# EasyEDA Pro project ProPrj_fallctf2025badge_2025-09-24.epro, schematic badge-v1.0

## Sheets
1 P1: Board Name: badge-v1.0; Create Date: 2025-08-06; Page Name: P1; Project Name: fallctf2025badge; Schematic Name: badge-v1.0; Update Date: 2025-08-08; Company: EasyEDA.com; Page Size: A4; Version: V1.0
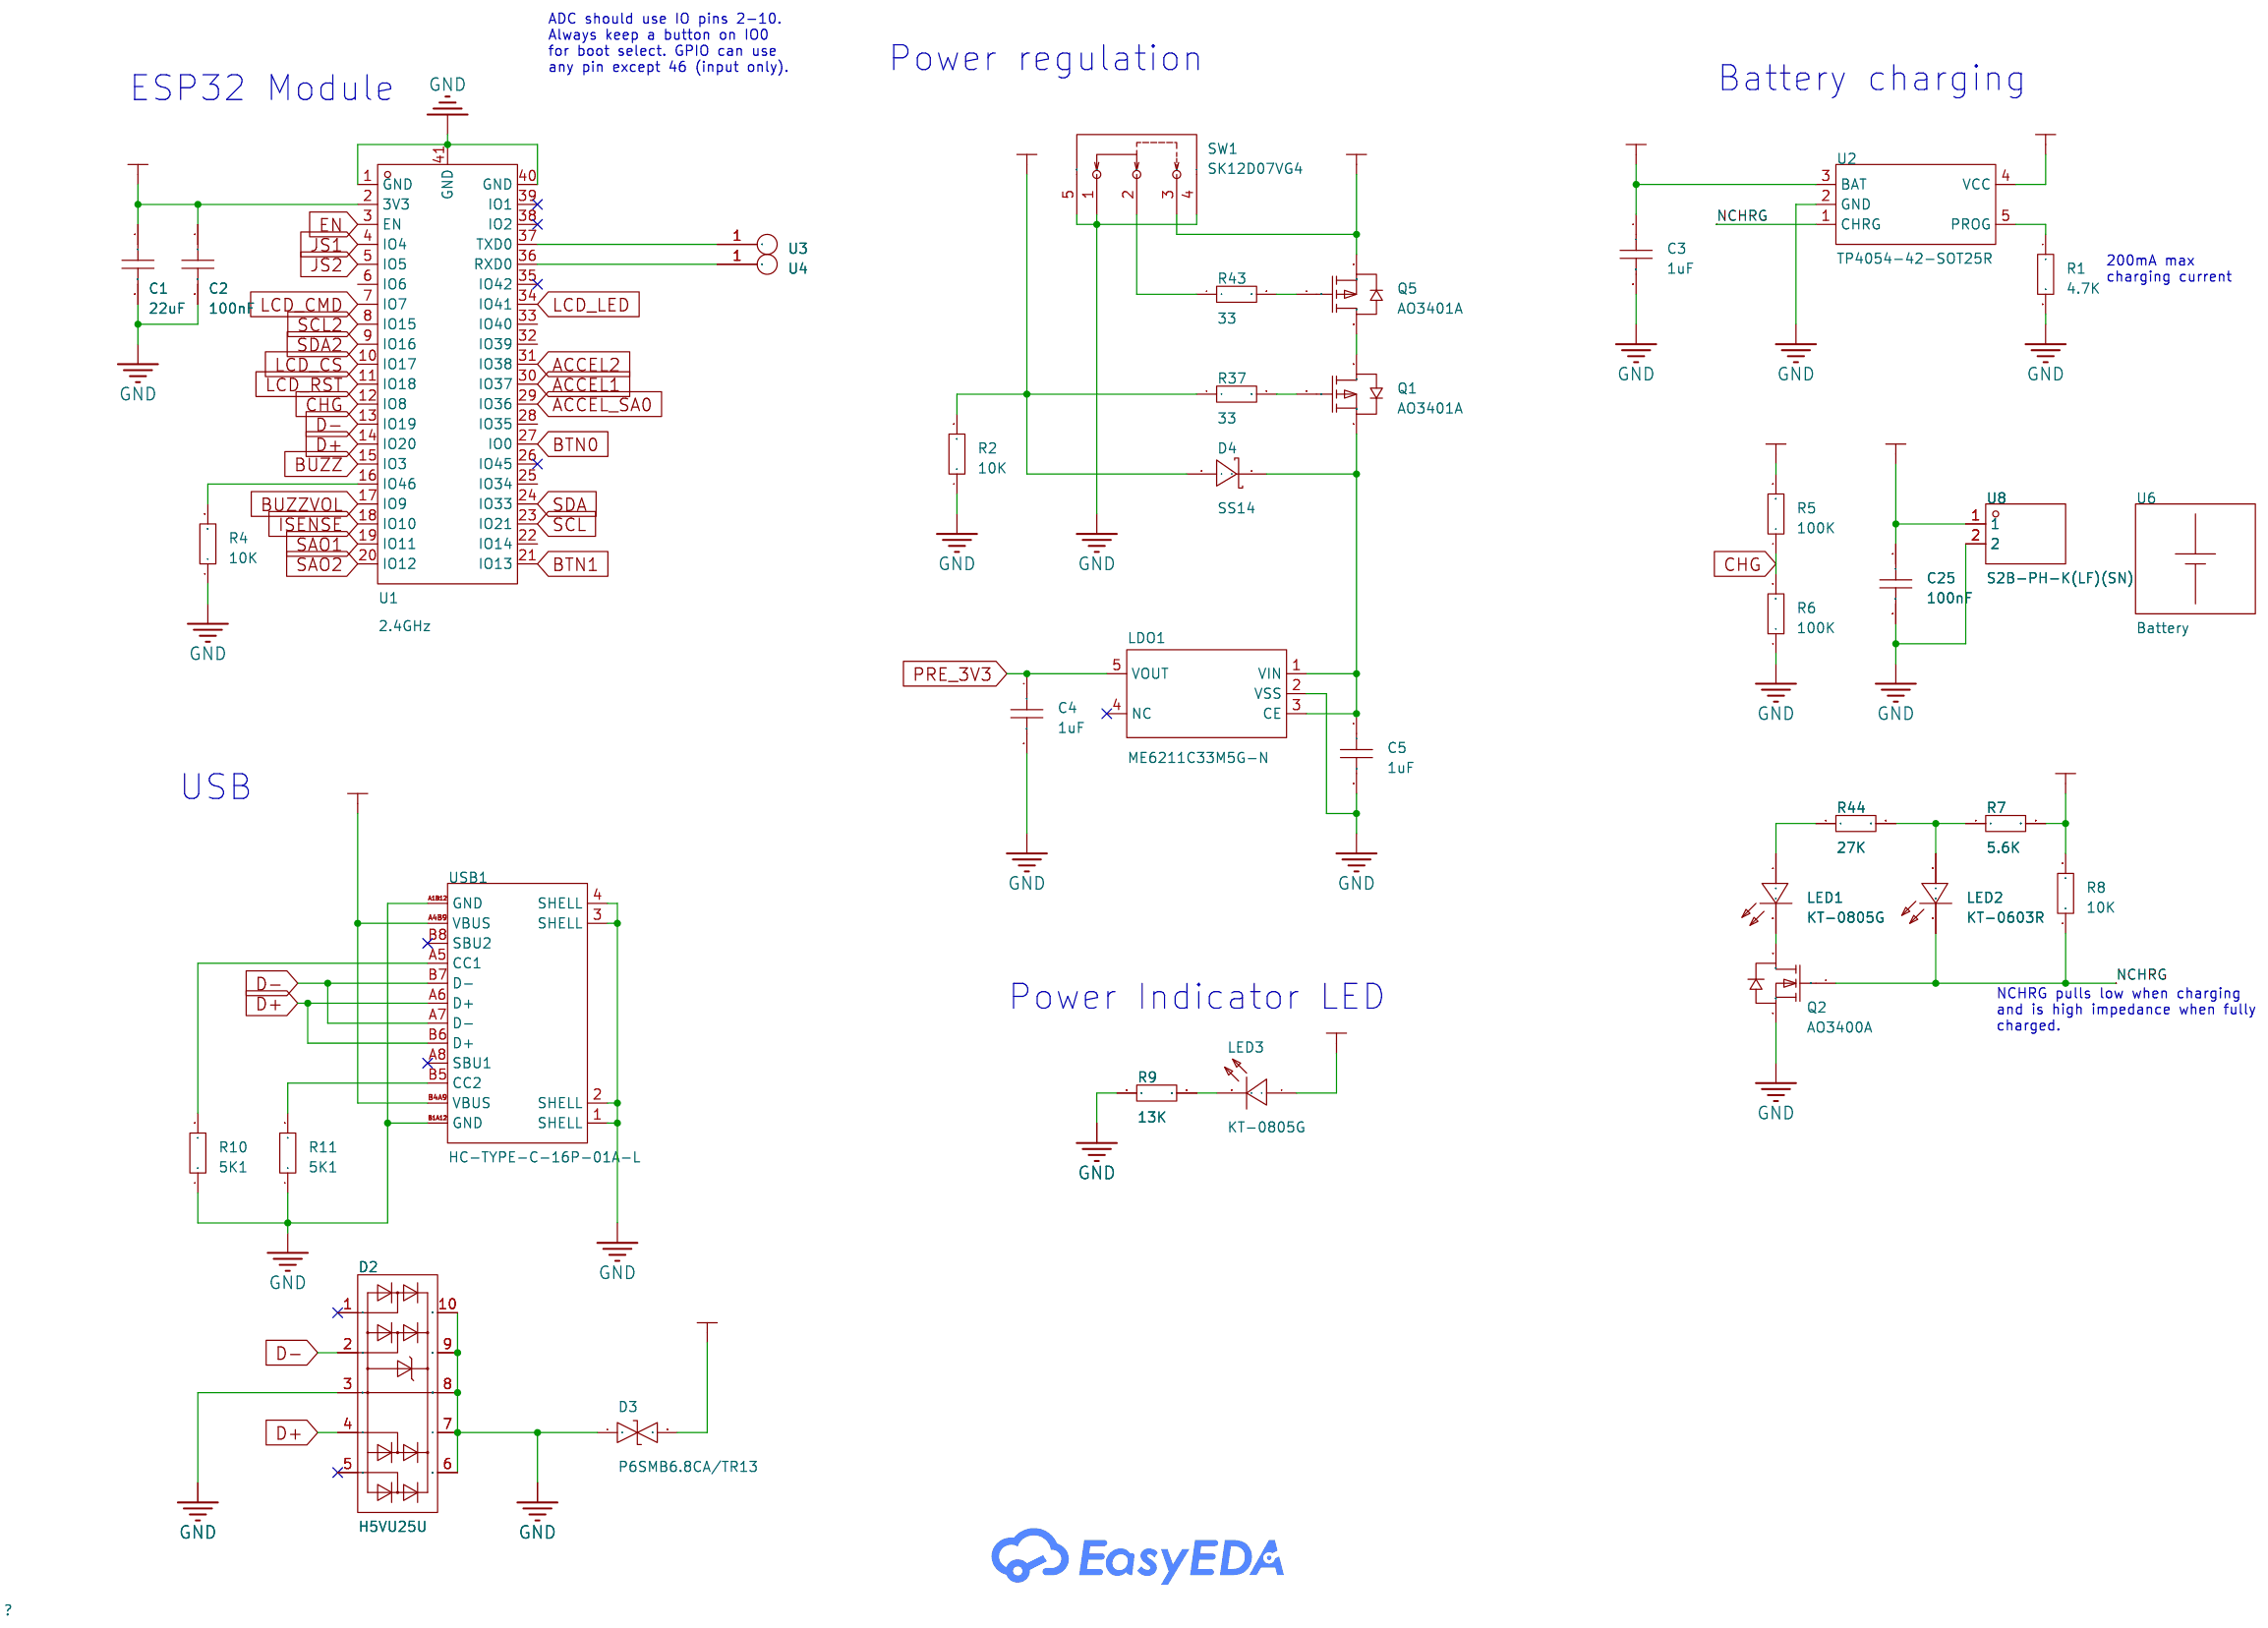
[diagram p8: P1]
2 P2: Page Name: P2; Update Date: 2025-08-07
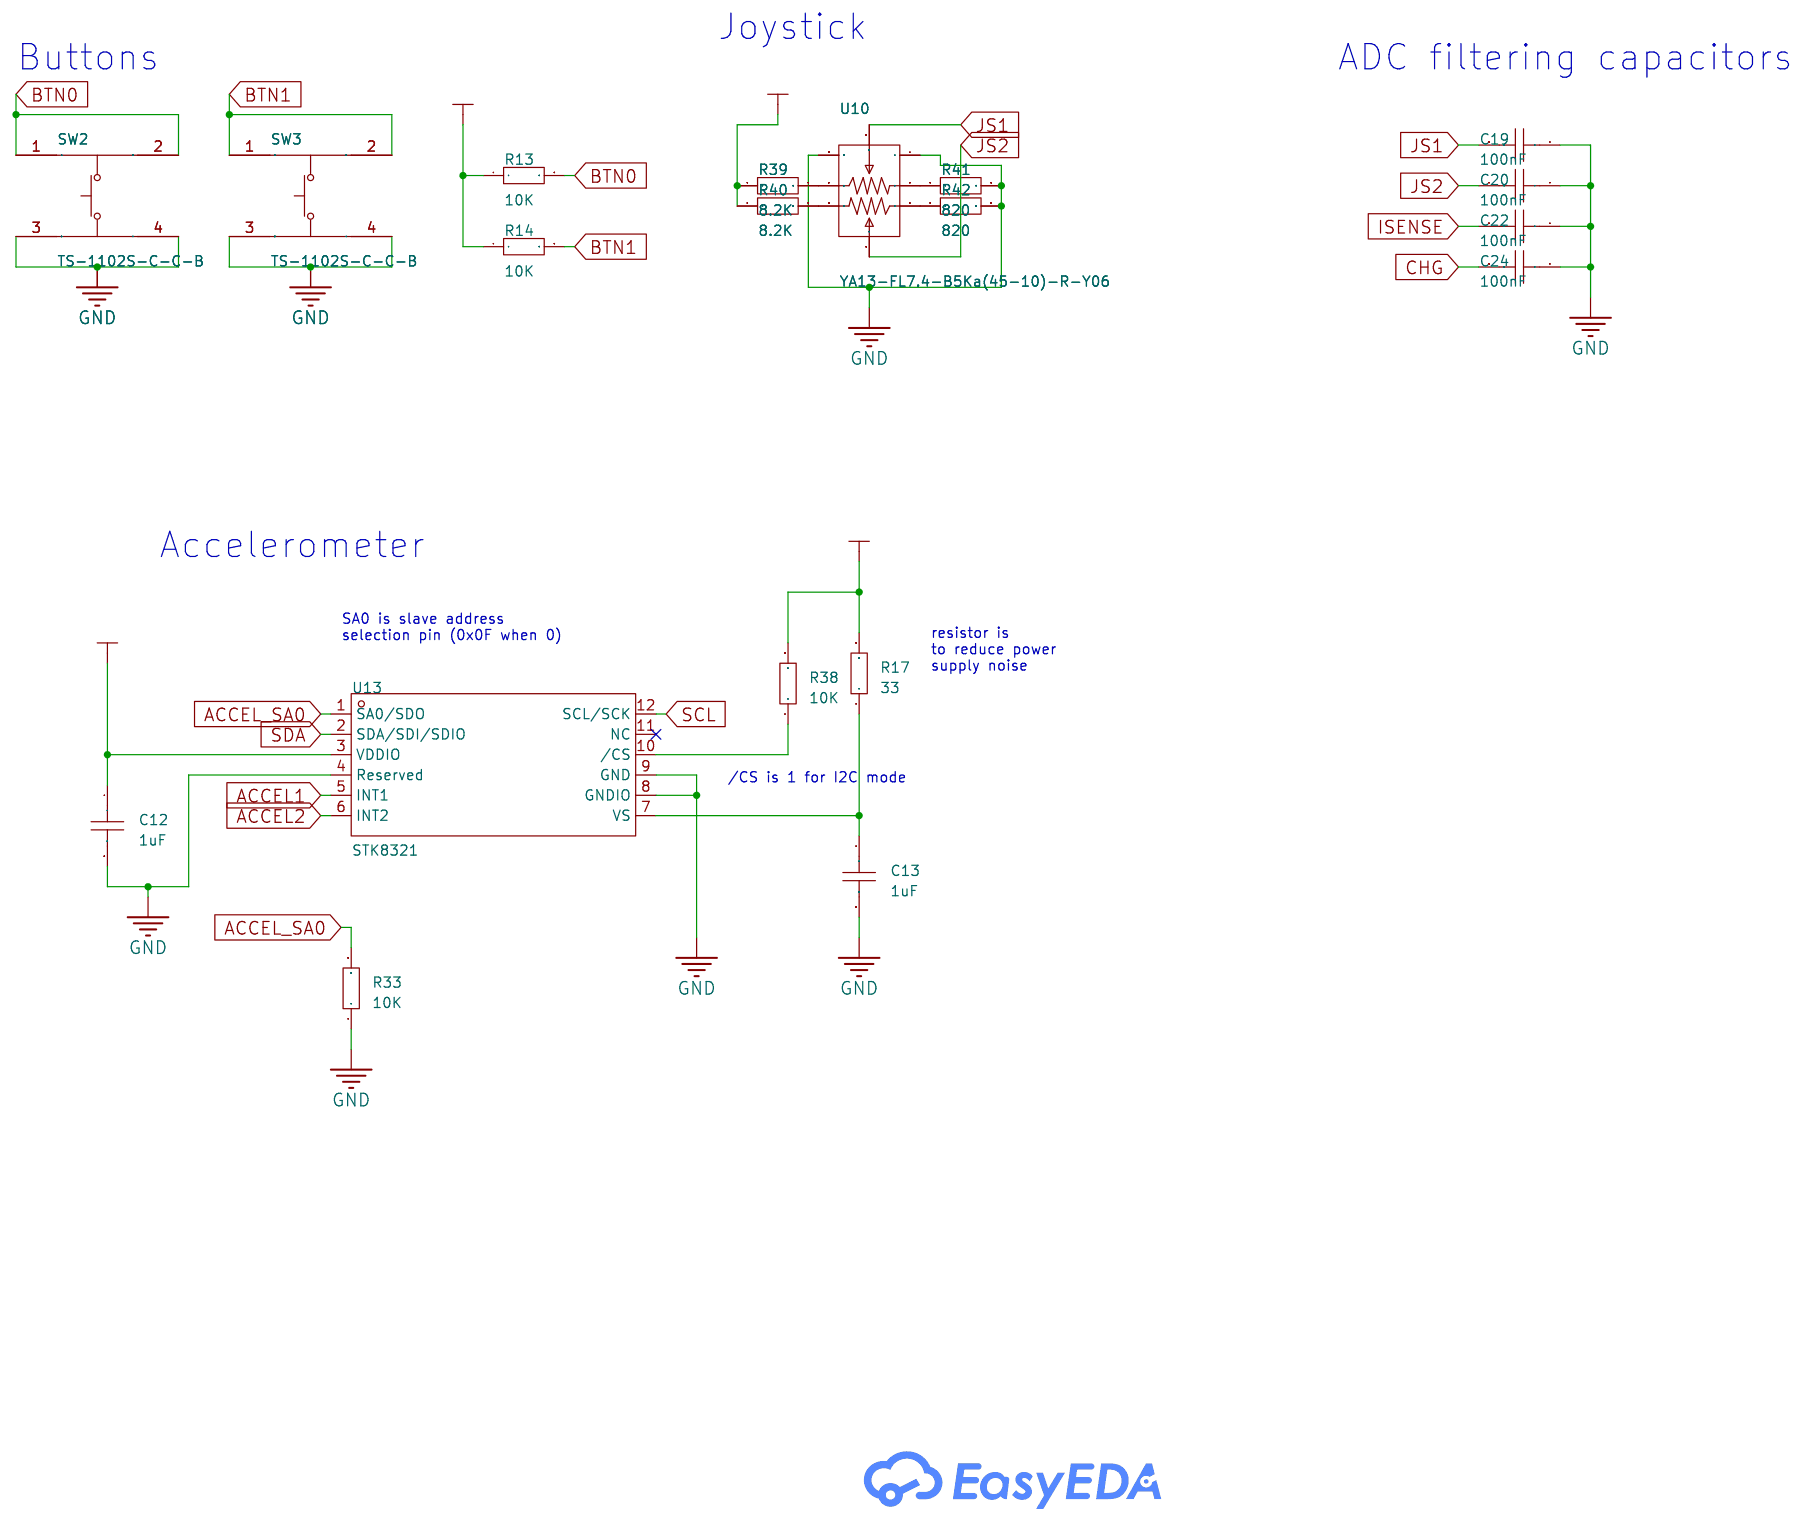
[diagram p9: P2]
3 P3: Page Name: P3; Update Date: 2025-08-07
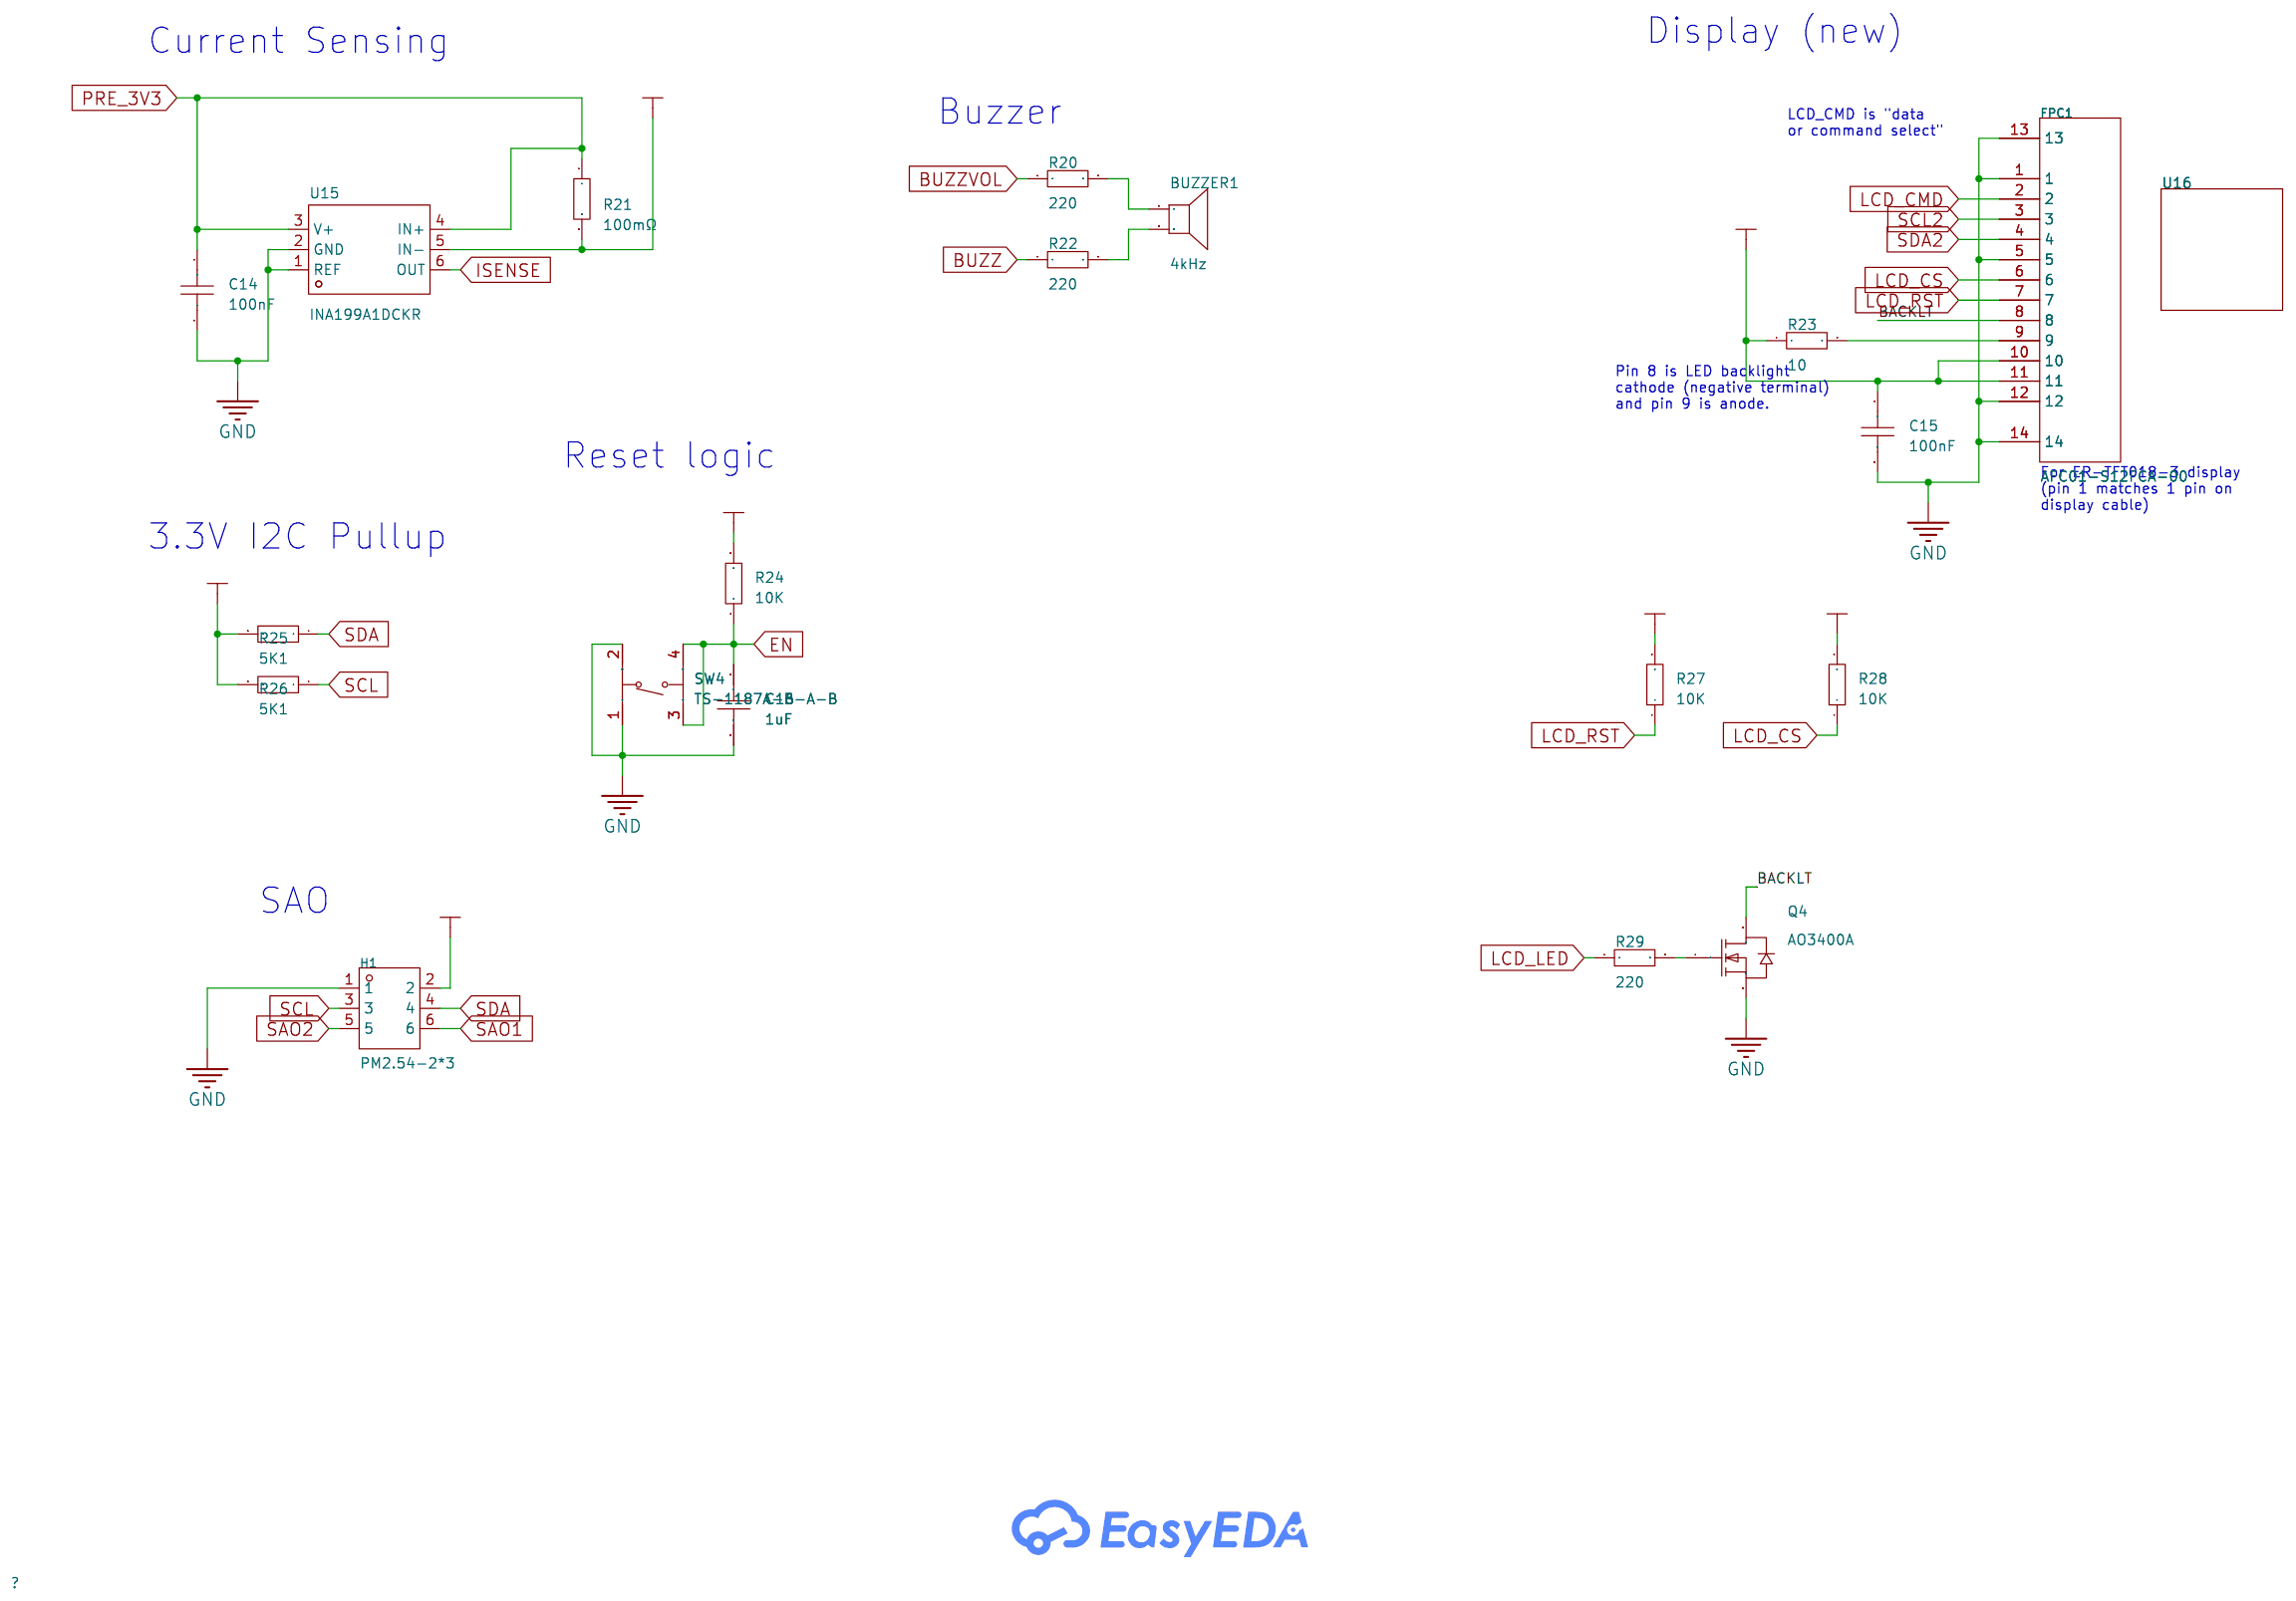
[diagram p10: P3]

## Parts
sheet P1
C1  22uF  [C0603]
C2  100nF  [C0603]
C3  1uF  [C0603]
C4  1uF  [C0603]
C5  1uF  [C0603]
C25  100nF  [C0603]
D2  H5VU25U  [DFN2510-10_L2.5-W1.0-P0.50-BL]
D3  P6SMB6.8CA/TR13  [SMB_L4.6-W3.6-LS5.3-BI]
D4  SS14  [SMA_L4.2-W2.6-LS5.3-RD]
LDO1  ME6211C33M5G-N  [SOT-23-5_L3.0-W1.7-P0.95-LS2.8-BL]
LED1  KT-0805G  [LED0805-R-RD]
LED2  KT-0603R  [LED0603-RD]
LED3  KT-0805G  [LED0805-R-RD]
Q1  AO3401A  [SOT-23_L2.9-W1.3-P1.90-LS2.4-BR]
Q2  AO3400A  [SOT-23-3_L2.9-W1.3-P1.90-LS2.4-BR]
Q5  AO3401A  [SOT-23_L2.9-W1.3-P1.90-LS2.4-BR]
R1  4.7K  [R0603]
R2  10K  [R0603]
R4  10K  [R0603]
R5  100K  [R0603]
R6  100K  [R0603]
R7  5.6K  [R0603]
R8  10K  [R0603]
R9  13K  [R0603]
R10  5K1  [R0603]
R11  5K1  [R0603]
R37  33  [R0603]
R43  33  [R0603]
R44  27K  [R0603]
SW1  SK12D07VG4  [SW-TH_SK12D07VG4]
U1  2.4GHz  [WIRELM-SMD_ESP32-S3-WROOM-1]
U2  TP4054-42-SOT25R  [SOT-23-5_L3.0-W1.7-P0.95-LS2.8-BL]
U3  -  [pad_THT]
U4  -  [pad_THT]
U6  Battery  [lipo_battery]
U8  S2B-PH-K(LF)(SN)  [CONN-TH_S2B-PH-K-LF-SN]
USB1  HC-TYPE-C-16P-01A-L  [USB-C-SMD_G-SWITCH_GT-USB-7010EN]
sheet P2
C12  1uF  [C0603]
C13  1uF  [C0603]
C19  100nF  [C0603]
C20  100nF  [C0603]
C22  100nF  [C0603]
C24  100nF  [C0603]
R13  10K  [R0603]
R14  10K  [R0603]
R17  33  [R0603]
R33  10K  [R0603]
R38  10K  [R0603]
R39  8.2K  [R0603]
R40  8.2K  [R0603]
R41  820  [R0603]
R42  820  [R0603]
SW2  TS-1102S-C-C-B  [KEY-SMD_4P-L6.0-W6.0-P4.50-LS8.6]
SW3  TS-1102S-C-C-B  [KEY-SMD_4P-L6.0-W6.0-P4.50-LS8.6]
U10  YA13-FL7.4-B5Ka(45-10)-R-Y06  [RES-ADJ-TH_YA13-FL7.4-B5KA-45-10-R-Y06_1]
U13  STK8321  [LGA-12_L2.0-W2.0-P0.50-TR]
sheet P3
BUZZER1  4kHz  [BUZ-TH_BD14.0-P7.60-D0.7]
C14  100nF  [C0603]
C15  100nF  [C0603]
C16  1uF  [C0603]
FPC1  AFC01-S12FCA-00  [FPC-SMD_AFC01-S12FCA-00]
H1  PM2.54-2*3  [HDR-TH_6P-P2.54-V-F-R2-C3-S2.54]
Q4  AO3400A  [SOT-23-3_L2.9-W1.3-P1.90-LS2.4-BR]
R20  220  [R0603]
R21  100mΩ  [R1206]
R22  220  [R0603]
R23  10  [R0603]
R24  10K  [R0603]
R25  5K1  [R0603]
R26  5K1  [R0603]
R27  10K  [R0603]
R28  10K  [R0603]
R29  220  [R0603]
SW4  TS-1187A-B-A-B  [SW-SMD_4P-L5.1-W5.1-P3.70-LS6.5-TL_H1.5]
U15  INA199A1DCKR  [SC-70-6_L2.2-W1.3-P0.65-LS2.1-BR]
U16  DISPLAY  [ER-TFT018-3]

## Library data of the parts
C1-C5 C12-C16 C19 C20 C22 C24 C25 = CAP_0603: Supplier Footprint: 0603
D2 = H5VU25U: polarity:Unidirectional Reverse Stand-Off Voltage (Vrwm):5V Maximum Clamping Voltage:14V Peak Pulse Current (Ipp):4A Peak Pulse Power Dissipation (Ppp):56W Breakdown Voltage:6V Reverse Leakage Current (Ir):1uA Number of Lines:Four channels Operating Tempe; LCSC Part Name: 丝印:0524P; Supplier Part: C7420374; Manufacturer: 宏迦橙; Supplier Footprint: DFN2510-10L; JLCPCB Part Class: Extended Part; Datasheet: https://atta.szlcsc.com/upload/public/pdf/source/20230630/91FD1DB17AB88B6832D3039FAE61FF10.pdf; Supplier: LCSC; polarity: Unidirectional; Reverse Stand-Off Voltage (Vrwm): 5V; Maximum Clamping Voltage: 14V; Peak Pulse Current (Ipp): 4A; Peak Pulse Power Dissipation (Ppp): 56W; Breakdown Voltage: 6V; Reverse Leakage Current (Ir): 1uA; Number of Lines: Four channels; Operating Temperature: -55℃~+155℃; Type: TVS
D3 = P6SMB6.8CA/TR13: Reverse Stand-Off Voltage (Vrwm):5.8V Clamping Voltage:10.5V Peak Pulse Current (Ipp):58.1A Peak Pulse Power Dissipation (Ppp):600W Voltage - Breakdown:6.45V Type:TVS; Supplier Part: C78395; Manufacturer: Brightking(君耀电子); Supplier Footprint: SMB(DO-214AA); JLCPCB Part Class: Basic Part; Datasheet: https://atta.szlcsc.com/upload/public/pdf/source/20160709/1468031879762.pdf; Supplier: LCSC; Reverse Stand-Off Voltage (Vrwm): 5.8V; Clamping Voltage: 10.5V; Peak Pulse Current (Ipp): 58.1A; Peak Pulse Power Dissipation (Ppp): 600W; Voltage - Breakdown: 6.45V; Type: TVS
D4 = SS14_C2480: Diode Configuration:Independent Type Forward Voltage (Vf@If):550mV@1A Reverse Voltage (Vr):40V Rectified Current:1A Reverse Leakage Current (Ir):300uA@40V; LCSC Part Name: 电压:40V 电流:1A; Supplier Part: C2480; Manufacturer: MDD(辰达半导体); Supplier Footprint: SMA(DO-214AC); JLCPCB Part Class: Basic Part; Datasheet: https://atta.szlcsc.com/upload/public/pdf/source/20240710/EF24798823EE33D63F154ED67BAC5E71.pdf; Supplier: LCSC; Diode Configuration: Independent Type; Forward Voltage (Vf@If): 550mV@1A; Reverse Voltage (Vr): 40V; Rectified Current: 1A; Reverse Leakage Current (Ir): 300uA@40V
LDO1 = ME6211C33M5G-N: Output Type:Fixed Voltage - Supply:6V Output Voltage:3.3V Output Voltage:3.3V Output Current:500mA Power Supply Rejection Ratio (PSRR):70dB@(1kHz) Voltage Dropout:120mV@(100mA) standby current:60uA Noise:50uVrms Features:Over Current Protection；Enable；Sho; LCSC Part Name: 输入6V 输出3.3V 500mA; Supplier Part: C82942; Manufacturer: MICRONE(南京微盟); Supplier Footprint: SOT-23-5; JLCPCB Part Class: Extended Part; Datasheet: https://atta.szlcsc.com/upload/public/pdf/source/20170918/C82942_1505727073070976520.pdf; Supplier: LCSC; Output Type: Fixed; Voltage - Supply: 6V; Output Voltage: 3.3V; Output Current: 500mA; Power Supply Rejection Ratio (PSRR): 70dB@(1kHz); Voltage Dropout: 120mV@(100mA); standby current: 60uA; Noise: 50uVrms; Features: Over Current Protection；Enable；Short Circuit Protection; Operating Temperature: -40℃~+150℃; Output Configuration: Positive; Number of Outputs: 1
LED1 LED3 = KT-0805G: Lamp Holder Type:- Emitted Color:Emerald Forward Voltage (VF):- Forward Voltage (VF):- Power Dissipation:- Forward Current:- Dominant Wavelength:- Dominant Wavelength:- Peak Wavelength:- Diode Configuration:- Lens Color:- Color Temperature:- Color Tempera; LCSC Part Name: 0805 翠绿 高亮; Supplier Part: C2297; Manufacturer: KENTO; Supplier Footprint: 0805; JLCPCB Part Class: Basic Part; Datasheet: https://atta.szlcsc.com/upload/public/pdf/source/20170209/1486607340485.pdf; Supplier: LCSC; Emitted Color: Emerald
LED2 = KT-0603R: Emitted Color:Red Power Dissipation:- Forward Current:- Dominant Wavelength:- Dominant Wavelength:- Peak Wavelength:- Diode Configuration:- Lens Color:- Color Temperature:- Color Temperature:- Viewing Angle:- Mounting Sytle:- Operating Temperature:-40℃~+8; LCSC Part Name: 0603 红灯 高亮; Supplier Part: C2286; Manufacturer: KENTO; Supplier Footprint: 0603; JLCPCB Part Class: Basic Part; Datasheet: https://atta.szlcsc.com/upload/public/pdf/source/20160616/1466072038404.pdf; Supplier: LCSC; Emitted Color: Red; Operating Temperature: -40℃~+85℃
Q1 Q5 = AO3401A_C15127: Type:1 Piece P-Channel Drain Source Voltage (Vdss): Continuous Drain Current (Id): Drain Source On Resistance (RDS(on)@Vgs,Id):44mΩ@10V,4.3A Power Dissipation (Pd): Gate Threshold Voltage (Vgs(th)@Id):1.3V@250uA Total Gate Charge (Qg@Vgs):12.2nC@4.5V Inpu; LCSC Part Name: 1个P沟道 耐压:30V 电流:4A; Supplier Part: C15127; Manufacturer: AOS; Supplier Footprint: SOT-23; JLCPCB Part Class: Basic Part; Datasheet: https://atta.szlcsc.com/upload/public/pdf/source/20160507/1462613609053.pdf; Supplier: LCSC; Type: 1 Piece P-Channel; Drain Source On Resistance (RDS(on)@Vgs,Id): 44mΩ@10V,4.3A; Gate Threshold Voltage (Vgs(th)@Id): 1.3V@250uA; Total Gate Charge (Qg@Vgs): 12.2nC@4.5V; Input Capacitance (Ciss@Vds): 1.2nF@15V; Operating Temperature: -55℃~+150℃@(Tj)
Q2 Q4 = AO3400A_C20917: Type:1 N-Channel Drain Source Voltage (Vdss): Continuous Drain Current (Id): Drain Source On Resistance (RDS(on)@Vgs,Id):26.5mΩ@10V,5.7A Power Dissipation (Pd): Gate Threshold Voltage (Vgs(th)@Id):1.5V@250uA Total Gate Charge (Qg@Vgs):7nC@4.5V Input Capac; LCSC Part Name: 1个N沟道 耐压:30V 电流:5.7A; Supplier Part: C20917; Manufacturer: AOS; Supplier Footprint: SOT-23-3L; JLCPCB Part Class: Basic Part; Datasheet: https://atta.szlcsc.com/upload/public/pdf/source/20140107/1457706668533.pdf; Supplier: LCSC; Type: 1 N-Channel; Drain Source On Resistance (RDS(on)@Vgs,Id): 26.5mΩ@10V,5.7A; Gate Threshold Voltage (Vgs(th)@Id): 1.5V@250uA; Total Gate Charge (Qg@Vgs): 7nC@4.5V; Input Capacitance (Ciss@Vds): 630pF@15V; Operating Temperature: -55℃~+150℃@(Tj)
R1 R2 R4-R11 R13 R14 R17 R20 R22-R29 R33 R37-R44 = Res_0603: Supplier Footprint: 0603
SW1 = SK12D07VG4: Circuit:SPDT Actuator Style:Rectangular columnar Pin Style:PCPin Switch Height:8.8mm Mounting Style:- Current Rating (DC):500mA Voltage Rating (DC):50V Current Rating (AC):- Voltage Rating (AC):- Mechanical Life:5千次 Operating Temperature:- Operating Tempe; LCSC Part Name: 3脚2档位 卧插 滑动开关; Supplier Part: C393937; Manufacturer: SHOU HAN(首韩); Supplier Footprint: 插件; JLCPCB Part Class: Extended Part; Datasheet: https://atta.szlcsc.com/upload/public/pdf/source/20190521/C393937_939FE26E571CC67D2D532E953108A1B0.pdf; Supplier: LCSC; Circuit: SPDT; Actuator Style: Rectangular columnar; Pin Style: PCPin; Switch Height: 8.8mm; Current Rating (DC): 500mA; Voltage Rating (DC): 50V; Mechanical Life: 5千次
U1 = ESP32-S2-SOLO-2-N4: Core Processor:ESP32-S2 chip Support Interface:I2C；GPIO；SPI；PWM；ADC；UART；USB；I2S Frequency:2.4GHz Output Power:19.5dBm Output Power:19.5dBm; Supplier Part: C3040594; Manufacturer: ESPRESSIF(乐鑫); Supplier Footprint: SMD-41P; JLCPCB Part Class: Extended Part; Datasheet: https://atta.szlcsc.com/upload/public/pdf/source/20241030/23A98F852E1EE1BC8A41B3B2EC18FA38.pdf; Supplier: LCSC; Core Processor: ESP32-S2 chip; Support Interface: I2C；GPIO；SPI；PWM；ADC；UART；USB；I2S; Output Power: 19.5dBm
U2 = TP4054-42-SOT25R: Supplier Part: C32574; Manufacturer: TOPPOWER(南京拓微); Supplier Footprint: SOT-23-5; JLCPCB Part Class: Extended Part; Datasheet: https://atta.szlcsc.com/upload/public/pdf/source/20140621/1457707095588.pdf; Supplier: LCSC
U3 U4 = pad_THT
U6 = lipo_battery
U8 = S2B-PH-K(LF)(SN): Pins Structure:1x2P Pitch:2mm Mounting Style:Right-Angle Reference Series:PH Number of Pins:2P Number of Rows:1 Number of PINs Per Row:2 Row Spacing:- Current Rating (Max):2A Contact Material:Brass Contact Plating:Tin Operating Temperature Range:-25℃~+85℃; LCSC Part Name: 1x2P 间距:2mm 弯插 系列:PH; Supplier Part: C265016; Manufacturer: JST; Supplier Footprint: 弯插,P=2mm; JLCPCB Part Class: Extended Part; Datasheet: https://atta.szlcsc.com/upload/public/pdf/source/20181010/C265101_22107ACC4D8714694FDA2DD97145FA81.pdf; Supplier: LCSC; Pins Structure: 1x2P; Pitch: 2mm; Mounting Style: Right-Angle; Reference Series: PH; Number of Pins: 2P; Number of Rows: 1; Number of PINs Per Row: 2; Current Rating (Max): 2A; Contact Material: Brass; Contact Plating: Tin; Operating Temperature Range: -25℃~+85℃; Rated Voltage (Max): 100V; Plastic Material: PA66; Flame Retardant Rating: UL94V-0; Supplementary Features: 打K脚; Colour: White; Z-Height of the Board: 4.8mm; X-Length of Bottom Edge on Board (Spacing Line): 5.9mm; Y-Width of Bottom Edge on Board: 7.6mm
USB1 = HC-TYPE-C-16P-01A-L: Connector Type:Type-C Standard:USB 3.1 Gender:Female Number of Ports:1 Number of Contacts:16P Mounting Style:卧贴 Current Rating - Power (Max):3A Contact Material:高导铜 Contact Plating:Gold Operating Temperature Range:-25℃~+85℃ Operating Temperature Range:-25; LCSC Part Name: Type-C 母 卧贴; Supplier Part: C2997432; Manufacturer: HCTL(华灿天禄); Supplier Footprint: SMD; JLCPCB Part Class: Extended Part; Datasheet: https://atta.szlcsc.com/upload/public/pdf/source/20221116/C788B956BC5B2689BB81EF44F8093A01.pdf; Supplier: LCSC; Connector Type: Type-C; Standard: USB 3.1; Gender: Female; Number of Ports: 1; Number of Contacts: 16P; Mounting Style: 卧贴; Current Rating - Power (Max): 3A; Contact Material: 高导铜; Contact Plating: Gold; Operating Temperature Range: -25℃~+85℃; Soldering Temperature(Max): 260℃
SW2 SW3 = TS-1102S-C-C-B: Circuit:SPST Actuator Style:Round Button Operating Force:260gf Mounting Style:Brick nogging Switch Length:6mm Switch Width:6mm Switch Height:5mm Strike Gundam:不带 Contact Current:50mA Voltage Rating (DC):12V Insulation Resistance:- Actuator/Cap Color:Black; LCSC Part Name: 6*6*5mm 立贴 轻触开关; Supplier Part: C381039; Manufacturer: XKB Connectivity(中国星坤); Supplier Footprint: SMD; JLCPCB Part Class: Extended Part; Datasheet: https://atta.szlcsc.com/upload/public/pdf/source/20211011/2711A6933F86C308D94098377C07E7B1.pdf; Supplier: LCSC; Circuit: SPST; Actuator Style: Round Button; Operating Force: 260gf; Mounting Style: Brick nogging; Switch Length: 6mm; Switch Width: 6mm; Switch Height: 5mm; Strike Gundam: 不带; Contact Current: 50mA; Voltage Rating (DC): 12V; Actuator/Cap Color: Black; With Lamp: No; Mechanical Life: 30万次; Operating Temperature: -20℃~+70℃
U10 = YA13-FL7.4-B5Ka(45-10)-R-Y06: Supplier Part: C37323742; Manufacturer: YTL(亚特联); Supplier Footprint: 插件-10P,16.7x16.7mm; JLCPCB Part Class: Extended Part; Datasheet: https://atta.szlcsc.com/upload/public/pdf/source/20240806/54F6EE709261E515BD8523FEFD4A47EF.pdf; Supplier: LCSC
U13 = STK8321: Supplier Part: C966924; Manufacturer: SENSORTEK(昇佳); Supplier Footprint: LGA-12(2x2); JLCPCB Part Class: Extended Part; Datasheet: https://atta.szlcsc.com/upload/public/pdf/source/20210108/C966924_A4D777CCA047E4BCE52C7136D49F7338.pdf; Supplier: LCSC
BUZZER1 = SFN-1407PA7.6: Driver Circuitry:Passive (external drive) Technology:Piezoelectric Voltage - Supply:- Voltage - Supply:- Frequency:4kHz Current Consumption:- Sound Pressure Level(SPL):85dB Diameter(φD):14mm Length:- Width:- Height:7.5mm Operating Temperature:- Operating; LCSC Part Name: 压电无源蜂鸣器; Supplier Part: C360603; Manufacturer: S&S(海旭); Supplier Footprint: 插件,D=14mm; JLCPCB Part Class: Extended Part; Datasheet: https://atta.szlcsc.com/upload/public/pdf/source/20190422/C360603_0050A9658ADA60D80C9948846F925782.pdf; Supplier: LCSC; Driver Circuitry: Passive (external drive); Technology: Piezoelectric; Sound Pressure Level(SPL): 85dB; Diameter(φD): 14mm; Height: 7.5mm
FPC1 = AFC01-S12FCA-00: Locking Feature:Clamshell Contact Type:Bottom Contact Number of Contacts:12P Pitch:0.5mm Mounting Type:卧贴 FFC, FCB Thickness:0.3mm FFC, FCB Thickness:0.3mm Height Above Board:2mm; LCSC Part Name: 间距:0.5mm P数:12P 翻盖式 下接; Supplier Part: C262661; Manufacturer: JS(钜硕电子); Supplier Footprint: SMD,P=0.5mm,卧贴; JLCPCB Part Class: Extended Part; Datasheet: https://atta.szlcsc.com/upload/public/pdf/source/20190816/C413942_2A72D1AC756EAE17EEDF756A339D4500.pdf; Supplier: LCSC; Locking Feature: Clamshell; Contact Type: Bottom Contact; Number of Contacts: 12P; Pitch: 0.5mm; Mounting Type: 卧贴; FFC, FCB Thickness: 0.3mm; Height Above Board: 2mm
H1 = PM2.54-2*3: Holes Structure:2x3P Pitch:2.54mm Row Spacing:2.54mm Circular Hole / Square Hole:方孔 Mounting Type:Straight Number of Rows:双排 Number of Holes:6P Current Rating (Max):2.5A Holes Direction:Top Insulation Height:8.5mm Operating Temperature Range:-40℃~+105℃ Op; LCSC Part Name: 间距:2.54mm 2x3P 直插; Supplier Part: C5116527; Manufacturer: ZHOURI(洲日); Supplier Footprint: 插件,P=2.54mm; JLCPCB Part Class: Extended Part; Datasheet: https://atta.szlcsc.com/upload/public/pdf/source/20220729/B685A447B6E7D9EA1A3EF6B07540DD20.pdf; Supplier: LCSC; Holes Structure: 2x3P; Pitch: 2.54mm; Row Spacing: 2.54mm; Circular Hole / Square Hole: 方孔; Mounting Type: Straight; Number of Rows: 双排; Number of Holes: 6P; Current Rating (Max): 2.5A; Holes Direction: Top; Insulation Height: 8.5mm; Operating Temperature Range: -40℃~+105℃
R21 = RL12FTNR100: Resistance: Tolerance:±1% Tolerance:±1% Power(Watts): Temperature Coefficient:±200ppm/℃ Temperature Coefficient:±200ppm/℃; LCSC Part Name: 100mΩ ±1% 500mW; Supplier Part: C188071; Manufacturer: 大毅科技; Supplier Footprint: 1206; JLCPCB Part Class: Extended Part; Datasheet: https://atta.szlcsc.com/upload/public/pdf/source/20180614/C188071_126E822E8169D657E3D39CA4797EDEB1.pdf; Supplier: LCSC; Tolerance: ±1%; Temperature Coefficient: ±200ppm/℃
SW4 = TS-1187A-B-A-B: Circuit:SPST Actuator Style:Round Button Operating Force:160gf Mounting Style:Brick nogging Switch Length:5.1mm Switch Width:5.1mm Switch Height:1.5mm Strike Gundam:不带 Contact Current:50mA Voltage Rating (DC):12V Insulation Resistance:- Actuator/Cap Color; LCSC Part Name: 5.1*5.1*1.5mm 立贴 轻触开关; Supplier Part: C318884; Manufacturer: XKB Connectivity(中国星坤); Supplier Footprint: SMD; JLCPCB Part Class: Basic Part; Datasheet: https://atta.szlcsc.com/upload/public/pdf/source/20200227/C318890_053E50208A88A7BA1965D8746000774E.pdf; Supplier: LCSC; Circuit: SPST; Actuator Style: Round Button; Operating Force: 160gf; Mounting Style: Brick nogging; Switch Length: 5.1mm; Switch Width: 5.1mm; Switch Height: 1.5mm; Strike Gundam: 不带; Contact Current: 50mA; Voltage Rating (DC): 12V; Actuator/Cap Color: 金色; With Lamp: No; Mechanical Life: 10万次; Operating Temperature: -30℃~+85℃
U15 = INA199A1DCKR: Supply Voltage:-300mV~26V Supply Voltage:-300mV~26V Supply Current:300uA Operating Temperature:-40℃~+125℃ Operating Temperature:-40℃~+125℃; Supplier Part: C59135; Manufacturer: TI(德州仪器); Supplier Footprint: SOT-363(SC-70-6); JLCPCB Part Class: Extended Part; Datasheet: https://www.ti.com/cn/lit/gpn/ina199; Supplier: LCSC; Supply Voltage: -300mV~26V; Supply Current: 300uA; Operating Temperature: -40℃~+125℃
U16 = ER-TFT018-3

## Nets
+3.3V: C1.1 C2.1 C12.1 C15.1 FPC1.10 FPC1.11 H1.2 LED3.1(A) R13.1 R14.1 R17.2 R21.2 R23.1 R24.2 R25.2 R26.2 R27.2 R28.2 R38.2 R39.1 R40.1 U1.2(3V3) U13.3(VDDIO) U15.5(IN-)
+5V: D3.2 D4.2(A) R2.2 R7.2 R8.2 R37.1 U2.4(VCC) USB1.A4B9(VBUS) USB1.B4A9(VBUS)
GND: C1.2 C2.2 C3.2 C4.2 C5.2 C12.2 C13.2 C14.2 C15.2 C16.2 C19.1 C20.1 C22.1 C24.1 C25.2 D2.3 D2.6 D2.7 D2.8 D2.9 D2.10 D3.1 FPC1.1 FPC1.5 FPC1.12 FPC1.13 FPC1.14 H1.1 LDO1.2(VSS) Q2.2(S) Q4.2(S) R1.2 R2.1 R4.1 R6.1 R9.1 R10.1 R11.1 R33.1 R41.2 R42.2 SW1.1 SW1.4 SW1.5 SW2.3 SW2.4 SW3.3 SW3.4 SW4.1(A) SW4.2(B) U1.1(GND) U1.40(GND) U1.41(GND) U2.2(GND) U8.2 U10.7 U10.8 U13.4(Reserved) U13.8(GNDIO) U13.9(GND) U15.1(REF) U15.2(GND) USB1.1(SHELL) USB1.2(SHELL) USB1.3(SHELL) USB1.4(SHELL) USB1.A1B12(GND) USB1.B1A12(GND)
VBAT: C3.1 C25.1 Q5.2(S) R5.2 SW1.3 U2.3(BAT) U8.1
ACCEL1: U1.30(IO37) U13.5(INT1)
ACCEL2: U1.31(IO38) U13.6(INT2)
ACCEL_SA0: R33.2 U1.29(IO36) U13.1(SA0/SDO)
BACKLT: FPC1.8 Q4.3(D)
BTN0: R13.2 SW2.1 SW2.2 U1.27(IO0)
BTN1: R14.2 SW3.1 SW3.2 U1.21(IO13)
BUZZ: R22.1 U1.15(IO3)
BUZZVOL: R20.1 U1.17(IO9)
CHG: C24.2 R5.1 R6.2 U1.12(IO8)
D+: D2.4 U1.14(IO20) USB1.A6(D+) USB1.B6(D+)
D-: D2.2 U1.13(IO19) USB1.A7(D-) USB1.B7(D-)
EN: C16.1 R24.1 SW4.3(C) SW4.4(D) U1.3(EN)
ISENSE: C22.2 U1.18(IO10) U15.6(OUT)
JS1: C19.2 U1.4(IO4) U10.2
JS2: C20.2 U1.5(IO5) U10.5
LCD_CMD: FPC1.2 U1.7(IO7)
LCD_CS: FPC1.6 R28.1 U1.10(IO17)
LCD_LED: R29.1 U1.34(IO41)
LCD_RST: FPC1.7 R27.1 U1.11(IO18)
NCHRG: LED2.1(K) Q2.1(G) R8.1 U2.1(CHRG)
PRE_3V3: C4.1 C14.1 LDO1.5(VOUT) R21.1 U15.3(V+) U15.4(IN+)
SAO1: H1.6 U1.19(IO11)
SAO2: H1.5 U1.20(IO12)
SCL: H1.3 R26.1 U1.23(IO21) U13.12(SCL/SCK)
SCL2: FPC1.3 U1.8(IO15)
SDA: H1.4 R25.1 U1.24(IO33) U13.2(SDA/SDI/SDIO)
SDA2: FPC1.4 U1.9(IO16)
$1N7837: R11.2 USB1.B5(CC2)
$1N7842: R10.2 USB1.A5(CC1)
$1N22902: R1.1 U2.5(PROG)
$1N23592: R4.2 U1.16(IO46)
$1N41964: U1.36(RXD0) U4.1
$1N50901: LED1.2(K) Q2.3(D)
$1N51117: LED3.2(K) R9.2
$1N58369: U1.37(TXD0) U3.1
$1N59276: Q1.1(G) R37.2
$1N59516: C5.1 D4.1(K) LDO1.1(VIN) LDO1.3(CE) Q1.2(S)
$1N68738: Q5.1(G) R43.2
$1N68744: Q1.3(D) Q5.3(D)
$1N68748: R43.1 SW1.2
$1N69793: LED1.1(A) R44.1
$1N69797: LED2.2(A) R7.1 R44.2
$2N18802: C13.1 R17.1 U13.7(VS)
$2N23538: R38.1 U13.10(/CS)
$2N23979: R39.2 U10.3
$2N24005: R40.2 U10.6
$2N24083: R41.1 U10.1
$2N24109: R42.1 U10.4
$3N4890: BUZZER1.2 R22.2
$3N9223: Q4.1(G) R29.2
$3N12560: BUZZER1.1 R20.2
$3N15384: FPC1.9 R23.2

Not connected (* = marked no-connect by the designer): D2 1* 5*; LDO1 4(NC)*; U1 6(IO6) 22(IO14) 25(IO34) 26(IO45)* 28(IO35) 32(IO39) 33(IO40) 35(IO42)* 38(IO2)* 39(IO1)*; U13 11(NC)*; USB1 A8(SBU1)* B8(SBU2)*

## Notes on the sheets
sheet 1
- ADC should use IO pins 2-10.
  Always keep a button on IO0
  for boot select. GPIO can use
  any pin except 46 (input only).
- Power regulation
- Battery charging
- ESP32 Module
- 200mA max
  charging current
- USB
- Power Indicator LED
- NCHRG pulls low when charging
  and is high impedance when fully
  charged.
sheet 2
- Joystick
- Buttons
- ADC filtering capacitors
- Accelerometer
- SA0 is slave address
  selection pin (0x0F when 0)
- resistor is
  to reduce power
  supply noise
- /CS is 1 for I2C mode
sheet 3
- Display (new)
- Current Sensing
- Buzzer
- LCD_CMD is "data
  or command select"
- Pin 8 is LED backlight
  cathode (negative terminal)
  and pin 9 is anode.
- Reset logic
- For ER-TFT018-3 display
  (pin 1 matches 1 pin on
  display cable)
- 3.3V I2C Pullup
- SAO
